# EAGLE schematic top (EAGLE 7.2.0)
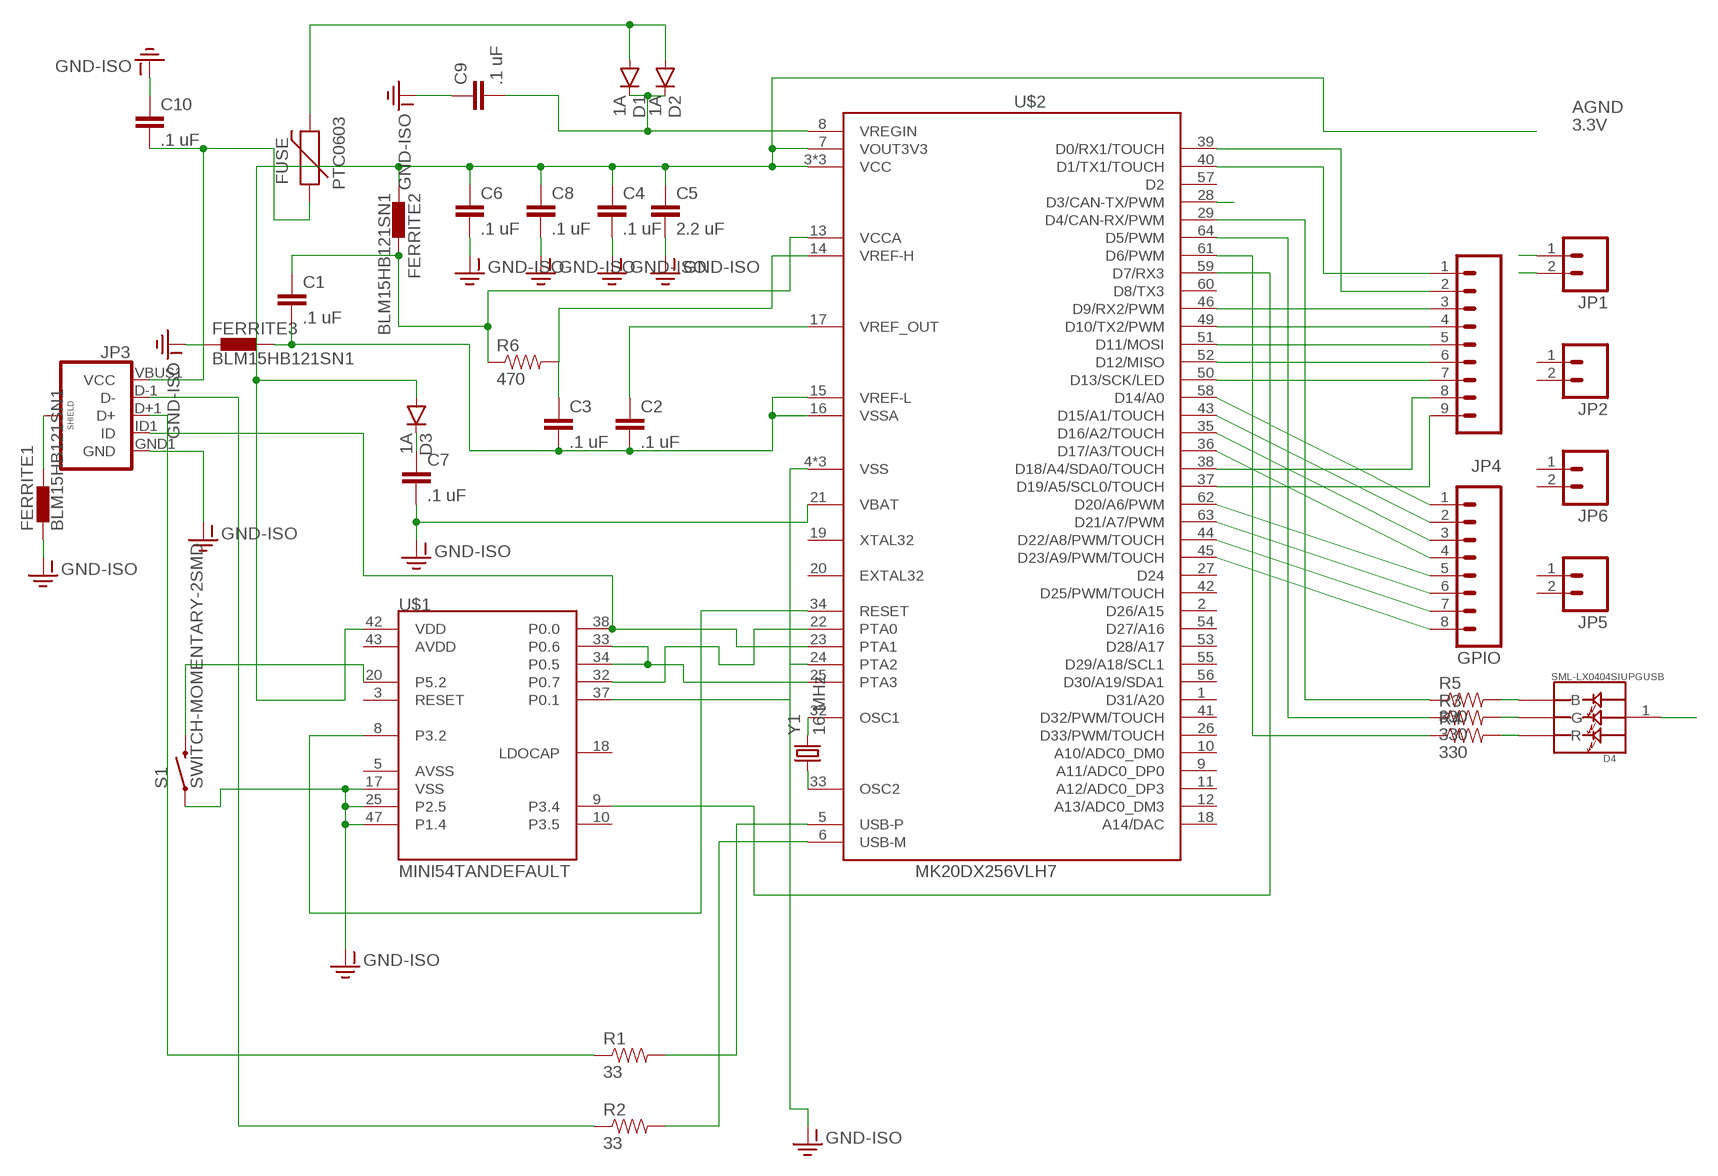
[diagram p0: schematic, sheet 1]

## Parts
C1  .1 uF  CAP0603-CAP  [0603-CAP]
C2  .1 uF  CAP0603-CAP  [0603-CAP]
C3  .1 uF  CAP0603-CAP  [0603-CAP]
C4  .1 uF  CAP0603-CAP  [0603-CAP]
C5  2.2 uF  CAP0603-CAP  [0603-CAP]
C6  .1 uF  CAP0603-CAP  [0603-CAP]
C7  .1 uF  CAP0603-CAP  [0603-CAP]
C8  .1 uF  CAP0603-CAP  [0603-CAP]
C9  .1 uF  CAP0603-CAP  [0603-CAP]
C10  .1 uF  CAP0603-CAP  [0603-CAP]
D1  1A  DIODEBAS16  [SOD-323]
D2  1A  DIODEBAS16  [SOD-323]
D3  1A  DIODEBAS16  [SOD-323]
D4  SML-LX0404SIUPGUSB  [1MM_SQ_4PAD]
FERRITE1  BLM15HB121SN1  [0402]
FERRITE2  BLM15HB121SN1  [0402]
FERRITE3  BLM15HB121SN1  [0402]
FUSE  PTC0603  [0603]
GPIO  M08SILK_FEMALE_PTH  [1X08]
JP1  M02LOCK  [1X02_LOCK]
JP2  M02LOCK  [1X02_LOCK]
JP3  USB_MICROB_PLUGCONN-11752  [USB-B-MICRO-SMD_V03]
JP4  M09  [1X09]
JP5  M02LOCK  [1X02_LOCK]
JP6  M02LOCK  [1X02_LOCK]
R1  33  RESISTOR0603  [0603-RES]
R2  33  RESISTOR0603  [0603-RES]
R3  330  RESISTOR0603  [0603-RES]
R4  330  RESISTOR0603  [0603-RES]
R5  330  RESISTOR0603  [0603-RES]
R6  470  RESISTOR0603  [0603-RES]
S1  SWITCH-MOMENTARY-2SMD  [TACTILE-SWITCH-SMD]
U$1  MINI54TANDEFAULT  [QFP50P900X900X160-48N]
U$2  MK20DX256VLH7  [QFP50P1200X1200X160-64N]
Y1  16 MHz  CRYSTAL5X3  [CRYSTAL-SMD-5X3]

## Nets
3.3V: C4.1 C5.1 C6.1 C8.1 D3.A D4.1(VDD) FERRITE2.1 JP1.1 U$1.42(VDD) U$2.3(VCC) U$2.7(VOUT3V3) U$2.30(VCC) U$2.48(VCC)
AGND: C1.2 C2.2 C3.2 FERRITE3.2 U$2.15(VREF-L) U$2.16(VSSA)
CE: JP4.3 U$2.46(D9/RX2/PWM)
D+: JP3.D+1(D+) R1.1
D-: JP3.D-1(D-) R2.1
GND-ISO: C4.2 C5.2 C6.2 C7.2 C8.2 C9.1 C10.1 FERRITE1.1 FERRITE3.1 JP1.2 JP3.GND1(GND) S1.1 U$1.17(VSS) U$1.25(P2.5) U$1.47(P1.4) U$2.4(VSS) U$2.21(VBAT) U$2.31(VSS) U$2.47(VSS)
N$1: C2.1 U$2.17(VREF_OUT)
N$2: C9.2 D1.C D2.C U$2.8(VREGIN)
N$3: U$2.14(VREF-H)
N$4: C1.1 FERRITE2.2 R6.1 U$2.13(VCCA)
N$5: C3.1 R6.2
N$6: FERRITE1.2 JP3.SHIELD1(SHIELD) JP3.SHIELD2(SHIELD) JP3.SHIELD3(SHIELD)
N$8: S1.3 U$1.20(P5.2)
N$9: C7.1 D3.C
N$11: U$1.8(P3.2) U$2.34(RESET)
N$12: JP3.ID1(ID) U$1.38(P0.0) U$2.23(PTA1)
N$13: U$1.33(P0.6) U$1.34(P0.5) U$2.25(PTA3)
N$14: U$1.32(P0.7) U$2.22(PTA0)
N$15: U$1.37(P0.1) U$2.24(PTA2)
N$16: U$1.9(P3.4) U$2.59(D7/RX3)
N$19: R1.2 U$2.5(USB-P)
N$20: R2.2 U$2.6(USB-M)
N$22: JP4.4 U$2.49(D10/TX2/PWM)
N$25: U$2.32(OSC1) Y1.3
N$26: U$2.33(OSC2) Y1.1
N$27: JP4.5 U$2.51(D11/MOSI)
N$28: JP4.6 U$2.52(D12/MISO)
N$29: GPIO.1 U$2.58(D14/A0)
N$30: GPIO.2 U$2.43(D15/A1/TOUCH)
N$31: GPIO.3 U$2.35(D16/A2/TOUCH)
N$32: D4.3(B) R5.2
N$33: D4.4(G) R3.2
N$35: D4.2(R) R4.2
N$36: GPIO.4 U$2.36(D17/A3/TOUCH)
N$37: GPIO.5 U$2.62(D20/A6/PWM)
N$38: GPIO.6 U$2.63(D21/A7/PWM)
N$39: GPIO.7 U$2.44(D22/A8/PWM/TOUCH)
N$40: GPIO.8 U$2.45(D23/A9/PWM/TOUCH)
N$41: R3.1 U$2.64(D5/PWM)
N$45: U$2.28(D3/CAN-TX/PWM)
N$62: R5.1 U$2.29(D4/CAN-RX/PWM)
N$63: C10.2 FUSE.1 JP3.VBUS1(VCC)
N$64: R4.1 U$2.61(D6/PWM)
SCK: JP4.7 U$2.50(D13/SCK/LED)
SCL_T: JP4.9 U$2.37(D19/A5/SCL0/TOUCH)
SDA_T: JP4.8 U$2.38(D18/A4/SDA0/TOUCH)
T_RX: JP4.2 U$2.39(D0/RX1/TOUCH)
T_TX: JP4.1 U$2.40(D1/TX1/TOUCH)
VIN: D1.A D2.A FUSE.2
Unconnected: JP2.1 JP2.2 JP5.1 JP5.2 JP6.1 JP6.2 U$1.3(RESET) U$1.5(AVSS) U$1.10(P3.5) U$1.18(LDOCAP) U$1.43(AVDD) U$2.1(D31/A20) U$2.2(D26/A15) U$2.9(A11/ADC0_DP0) U$2.10(A10/ADC0_DM0) U$2.11(A12/ADC0_DP3) U$2.12(A13/ADC0_DM3) U$2.18(A14/DAC) U$2.19(XTAL32) U$2.20(EXTAL32) U$2.26(D33/PWM/TOUCH) U$2.27(D24) U$2.41(D32/PWM/TOUCH) U$2.42(D25/PWM/TOUCH) U$2.53(D28/A17) U$2.54(D27/A16) U$2.55(D29/A18/SCL1) U$2.56(D30/A19/SDA1) U$2.57(D2) U$2.60(D8/TX3)

## Library data of the parts
C1-C10 = SparkFun-Passives:CAP: Capacitor Standard 0603 ceramic capacitor, and 0.1" leaded capacitor.
D1-D3 = SparkFun-DiscreteSemi:DIODE: Diode These are standard reverse protection diodes and small signal diodes. SMA package can handle up to about 1A. SOD-323 can handle about 200mA. What the SOD-323 package when ordering, there are some mfgs out there that are 5-pin packages.; PROD_ID: DIO-09646; VALUE: 250mA/100V
D4 = leds:SML-LX0404SIUPGUSB: 1mm^2 RGB LED; DIGIKEY: 67-2125-1-ND
FERRITE1-FERRITE3 = inductors:BLM15H: EMIFIL (R) Chip Ferrite Bead for GHz Noise Source: http://www.murata.com/ Ferrite Bead BLM15H.pdf
FUSE = SparkFun-PowerIC:PTC: Resettable Fuse PTC Resettable Fuse. Spark Fun Electronics SKU : COM-08357
GPIO = SparkFun-Connectors:M08: Header 8 Standard 8-pin 0.1" header. Use with straight break away headers (SKU : PRT-00116), right angle break away headers (PRT-00553), swiss pins (PRT-00743), machine pins (PRT-00117), and female headers (PRT-00115).; PROD_ID: CONN-08438
JP1 JP2 JP5 JP6 = SparkFun-Connectors:M02: Standard 2-pin 0.1" header. Use with - straight break away headers ( PRT-00116) - right angle break away headers (PRT-00553) - swiss pins (PRT-00743) - machine pins (PRT-00117) - female headers (PRT-00115) Molex polarized connector foot print use with: PRT-08233 with associated crimp pins and housings. 2.54_SCREWTERM for use with PRT-10571. 3.5mm Screw Terminal footprints for PRT-08084 5mm Screw Terminal footprints for use with PRT-08432
JP3 = SparkFun-Connectors:USB_MICROB_PLUG: USB Micro-B connectors Some male, some female. Watch your step!; PROD_ID: CONN-11752
JP4 = SparkFun-Connectors:M09: Header 9 Standard 9-pin 0.1" header. Use with straight break away headers (SKU : PRT-00116), right angle break away headers (PRT-00553), swiss pins (PRT-00743), machine pins (PRT-00117), and female headers (PRT-00115).
R1-R6 = SparkFun-Resistors:RESISTOR: Resistor Basic schematic elements and footprints for 0603, 1206, and PTH resistors.
S1 = SparkFun-Electromechanical:SWITCH-MOMENTARY-2: Various NO switches- pushbuttons, reed, etc; PROD_ID: SWCH-08247
U$1 = Teensy_3_Series_Chip_v1.2:MINI54TAN: MINI54TAN Bootloader from PJRC.com, preprogrammed with Teensy 3.0 bootloader. https://www.pjrc.com/store/ic_mini54_tqfp.html
U$2 = Teensy_3_Series_Chip_v1.2:MK20DX256VLH7: This is a footprint for the MK20dx256VHL7, the chip at the heart of the Teensy 3.1. Notable upgrades over the Teensy 3.0 include more Flash Memory, RAM, a DAC output, additional ADC pins, etc. Remember, if you want to use USB, VOut3v3 has to be attached to the 3.3V bus.
Y1 = SparkFun-FreqCtrl:CRYSTAL: Various standard crystals. Proven footprints.; PROD_ID: XTAL-08218